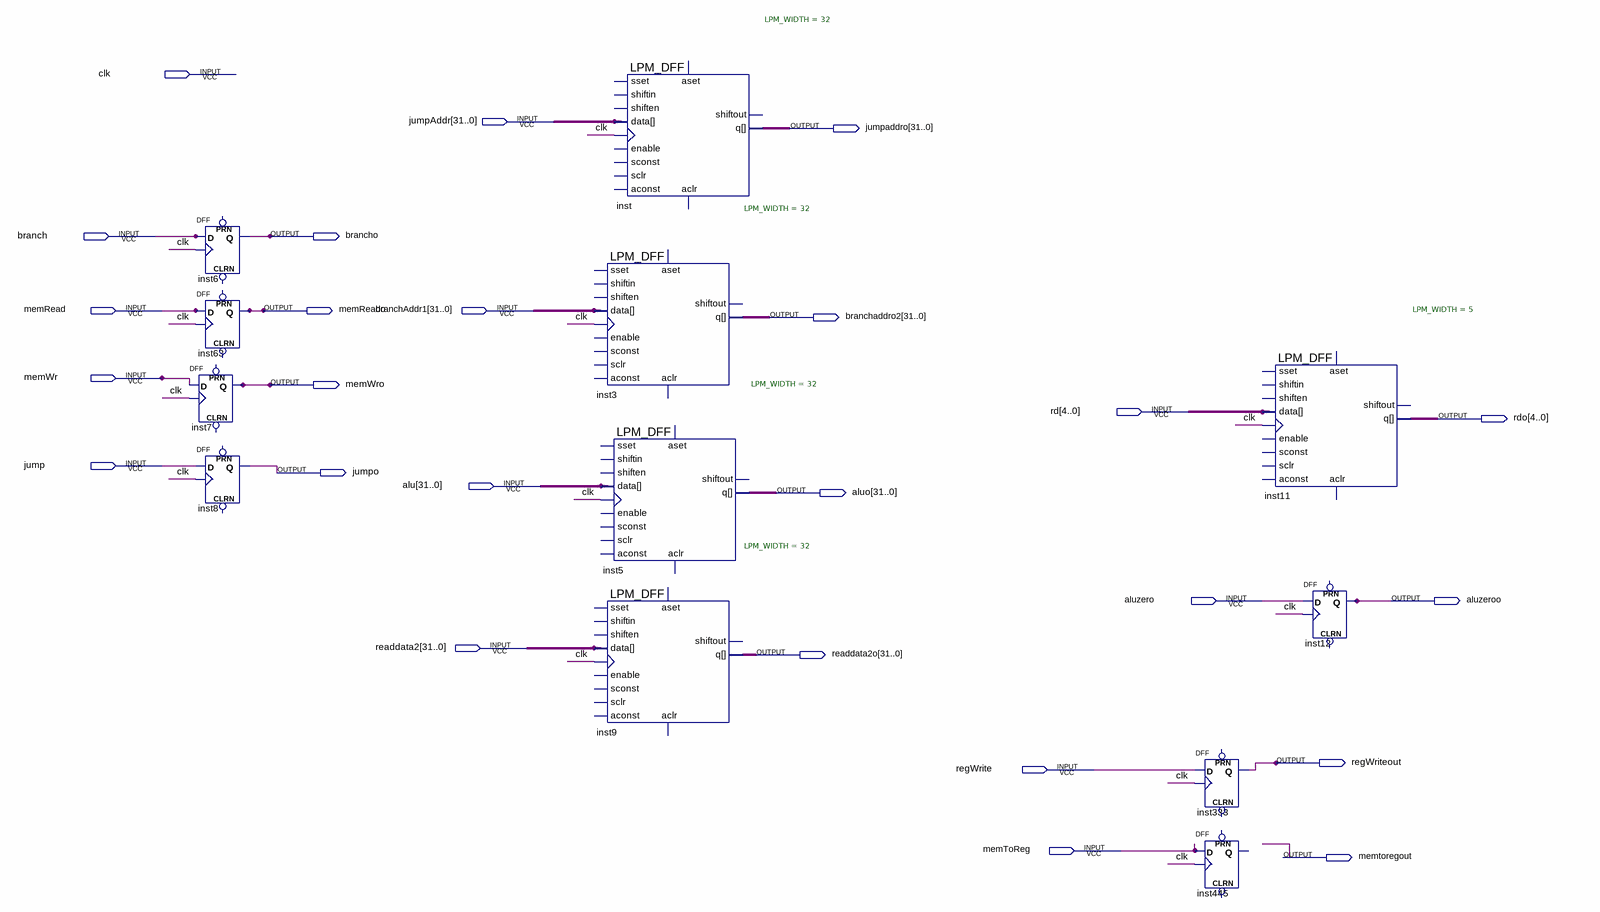
[diagram p0: schematic sheet]
// Quartus schematic ex.bdf as structural Verilog: 12 symbols, 25 pins
module ex (
  input  clk,
  input  [31:0] jumpAddr,
  input  branch,
  input  memRead,
  input  [31:0] branchAddr1,
  input  memWr,
  input  [4:0] rd,
  input  jump,
  input  [31:0] alu,
  input  aluzero,
  input  [31:0] readdata2,
  input  regWrite,
  input  memToReg,
  output [31:0] jumpaddro,
  output brancho,
  output memReado,
  output [31:0] branchaddro2,
  output memWro,
  output [4:0] rdo,
  output jumpo,
  output [31:0] aluo,
  output aluzeroo,
  output [31:0] readdata2o,
  output regWriteout,
  output memtoregout
);

  DFF inst6 (.CLK(clk), .D(branch), .Q(brancho));  // open: CLRN, PRN
  DFF inst63 (.CLK(clk), .D(memRead), .Q(memReado));  // open: CLRN, PRN
  DFF inst7 (.CLK(clk), .D(memWr), .Q(memWro));  // open: CLRN, PRN
  DFF inst8 (.CLK(clk), .D(jump), .Q(jumpo));  // open: CLRN, PRN
  LPM_DFF #(.LPM_WIDTH(32)) inst3 (
    .clock(clk), .data(branchAddr1), .q(branchaddro2));  // open: shiftin, shiften, enable, aconst, sclr, sconst, sset, aset, aclr, shiftout
  LPM_DFF #(.LPM_WIDTH(32)) inst9 (
    .clock(clk), .data(readdata2), .q(readdata2o));  // open: shiftin, shiften, enable, aconst, sclr, sconst, sset, aset, aclr, shiftout
  LPM_DFF #(.LPM_WIDTH(32)) inst (
    .clock(clk), .data(jumpAddr), .q(jumpaddro));  // open: shiftin, shiften, enable, aconst, sclr, sconst, sset, aset, aclr, shiftout
  LPM_DFF #(.LPM_WIDTH(32)) inst5 (
    .clock(clk), .data(alu), .q(aluo));  // open: shiftin, shiften, enable, aconst, sclr, sconst, sset, aset, aclr, shiftout
  DFF inst333 (.CLK(clk), .D(regWrite), .Q(regWriteout));  // open: CLRN, PRN
  DFF inst445 (.CLK(clk), .D(memToReg));  // open: CLRN, PRN, Q
  LPM_DFF #(.LPM_WIDTH(5)) inst11 (
    .clock(clk), .data(rd), .q(rdo));  // open: shiftin, shiften, enable, aconst, sclr, sconst, sset, aset, aclr, shiftout
  DFF inst12 (.CLK(clk), .D(aluzero), .Q(aluzeroo));  // open: CLRN, PRN
endmodule
